# EAGLE design ESCON Module 48 (EAGLE 9.6.2)

## Sheet 1 of 3
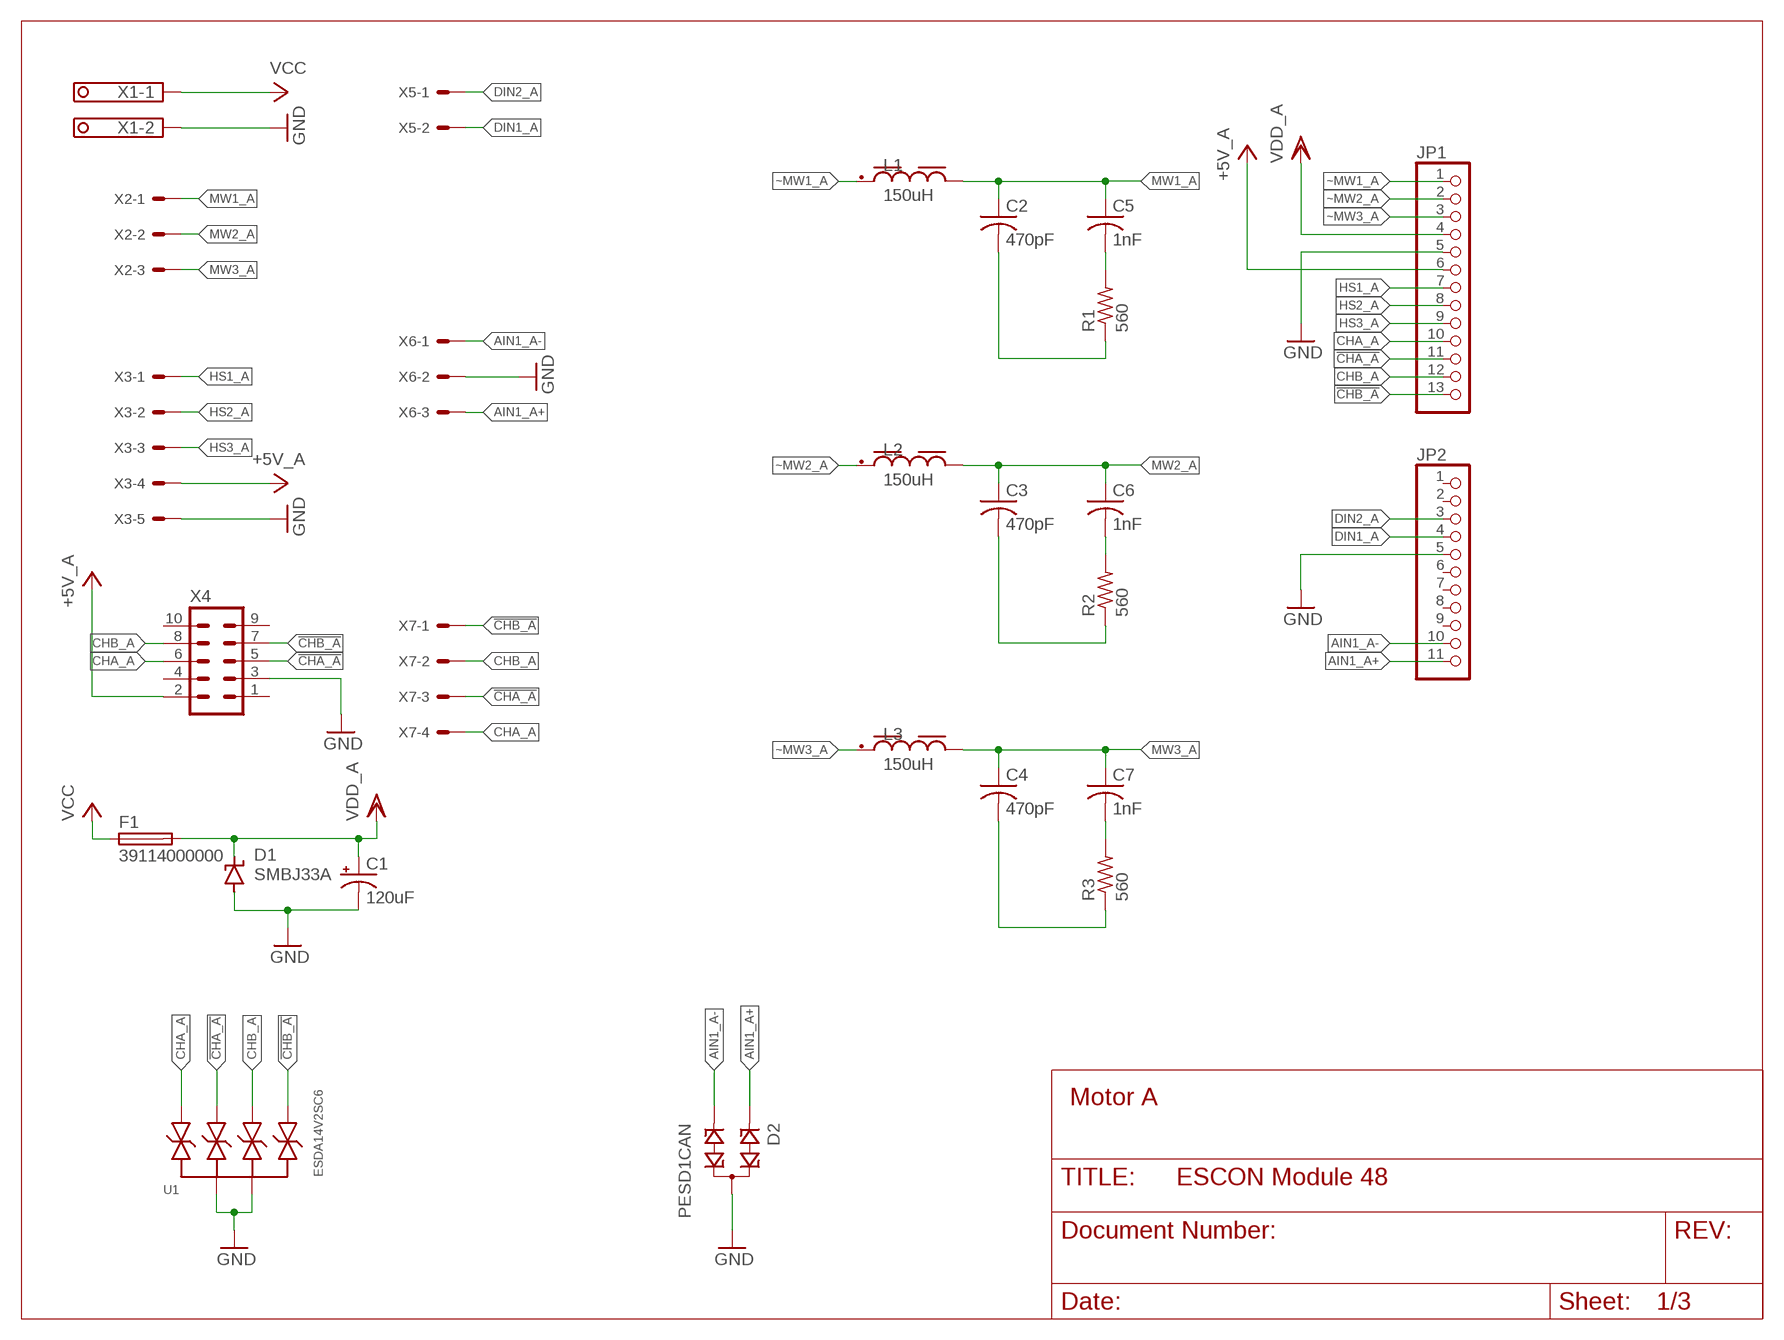
[diagram p0: schematic, sheet 1]

### Parts
C1  120uF  CPOL-USE7.5-16  [E7,5-16]
C2  470pF  C-USC0603  [C0603]
C3  470pF  C-USC0603  [C0603]
C4  470pF  C-USC0603  [C0603]
C5  1nF  C-USC0603  [C0603]
C6  1nF  C-USC0603  [C0603]
C7  1nF  C-USC0603  [C0603]
D1  SMBJ33A  SUPPRESSOR-SMBJ  [SMBJ]
D2  PESD1CAN  [SOT23]
F1  39114000000  TE5  [TE5]
JP1  PINHD-1X13  [1X13]
JP2  PINHD-1X11  [1X11]
L1  150uH  WE-PD_1210_7447709151  [WE-PD_1210]
L2  150uH  WE-PD_1210_7447709151  [WE-PD_1210]
L3  150uH  WE-PD_1210_7447709151  [WE-PD_1210]
R1  560  R-US_R0603  [R0603]
R2  560  R-US_R0603  [R0603]
R3  560  R-US_R0603  [R0603]
U1  ESDA14V2SC6  [SOT95P280X145-6N]
X1  TERMINAL-BLOCK-3.5MM-2-PIN-LONG-PAD  [TERMINAL-BLOCK-2-PIN-3.5MM-LONG-PAD]
X2  JST-XH-03-PIN-LONG-PAD  [JST-XH-03-PACKAGE-LONG-PAD]
X3  JST-XH-05-PIN-LONG-PAD  [JST-XH-05-PACKAGE-LONG-PAD]
X4  ML10LP-V  [10LP-V]
X5  JST-XH-02-PIN-LONG-PAD  [JST-XH-02-PACKAGE-LONG-PAD]
X6  JST-XH-03-PIN-LONG-PAD  [JST-XH-03-PACKAGE-LONG-PAD]
X7  JST-XH-04-PIN-LONG-PAD  [JST-XH-04-PACKAGE-LONG-PAD]

### Nets
!CHA_A [signal]: JP1.11 U1.3 X4.5 X7.3
!CHB_A [signal]: JP1.13 U1.6 X4.7 X7.1
+5V_A [power]: JP1.6 X3.4 X4.2
AIN1_A+ [signal]: D2.1 JP2.11 X6.3
AIN1_A- [signal]: D2.2 JP2.10 X6.1
CHA_A [signal]: JP1.10 U1.1 X4.6 X7.4
CHB_A [signal]: JP1.12 U1.4 X4.8 X7.2
DIN1_A [signal]: JP2.4 X5.2
DIN2_A [signal]: JP2.3 X5.1
GND [signal]: C1.- D1.A D2.3 JP1.5 JP2.5 U1.2 U1.5 X1.2 X3.5 X4.3 X6.2 ; also sheet 2,3
HS1_A [motor]: JP1.7 X3.1
HS2_A [motor]: JP1.8 X3.2
HS3_A [motor]: JP1.9 X3.3
MW1_A [motor]: C2.1 C5.1 L1.2 X2.1
MW2_A [motor]: C3.1 C6.1 L2.2 X2.2
MW3_A [motor]: C4.1 C7.1 L3.2 X2.3
N$1: C5.2 R1.2
N$2: C6.2 R2.2
N$3: C7.2 R3.2
N$15: C4.2 R3.1
N$16: C3.2 R2.1
N$17: C2.2 R1.1
VCC [power]: F1.1 X1.1 ; also sheet 2,3
VDD_A [power]: C1.+ D1.C F1.2 JP1.4
~MW1_A [motor]: JP1.1 L1.1
~MW2_A [motor]: JP1.2 L2.1
~MW3_A [motor]: JP1.3 L3.1
Unconnected: JP2.1 JP2.2 JP2.6 JP2.7 JP2.8 JP2.9 X4.1 X4.4 X4.9 X4.10

### Notes on the sheet
- Motor A

## Sheet 2 of 3
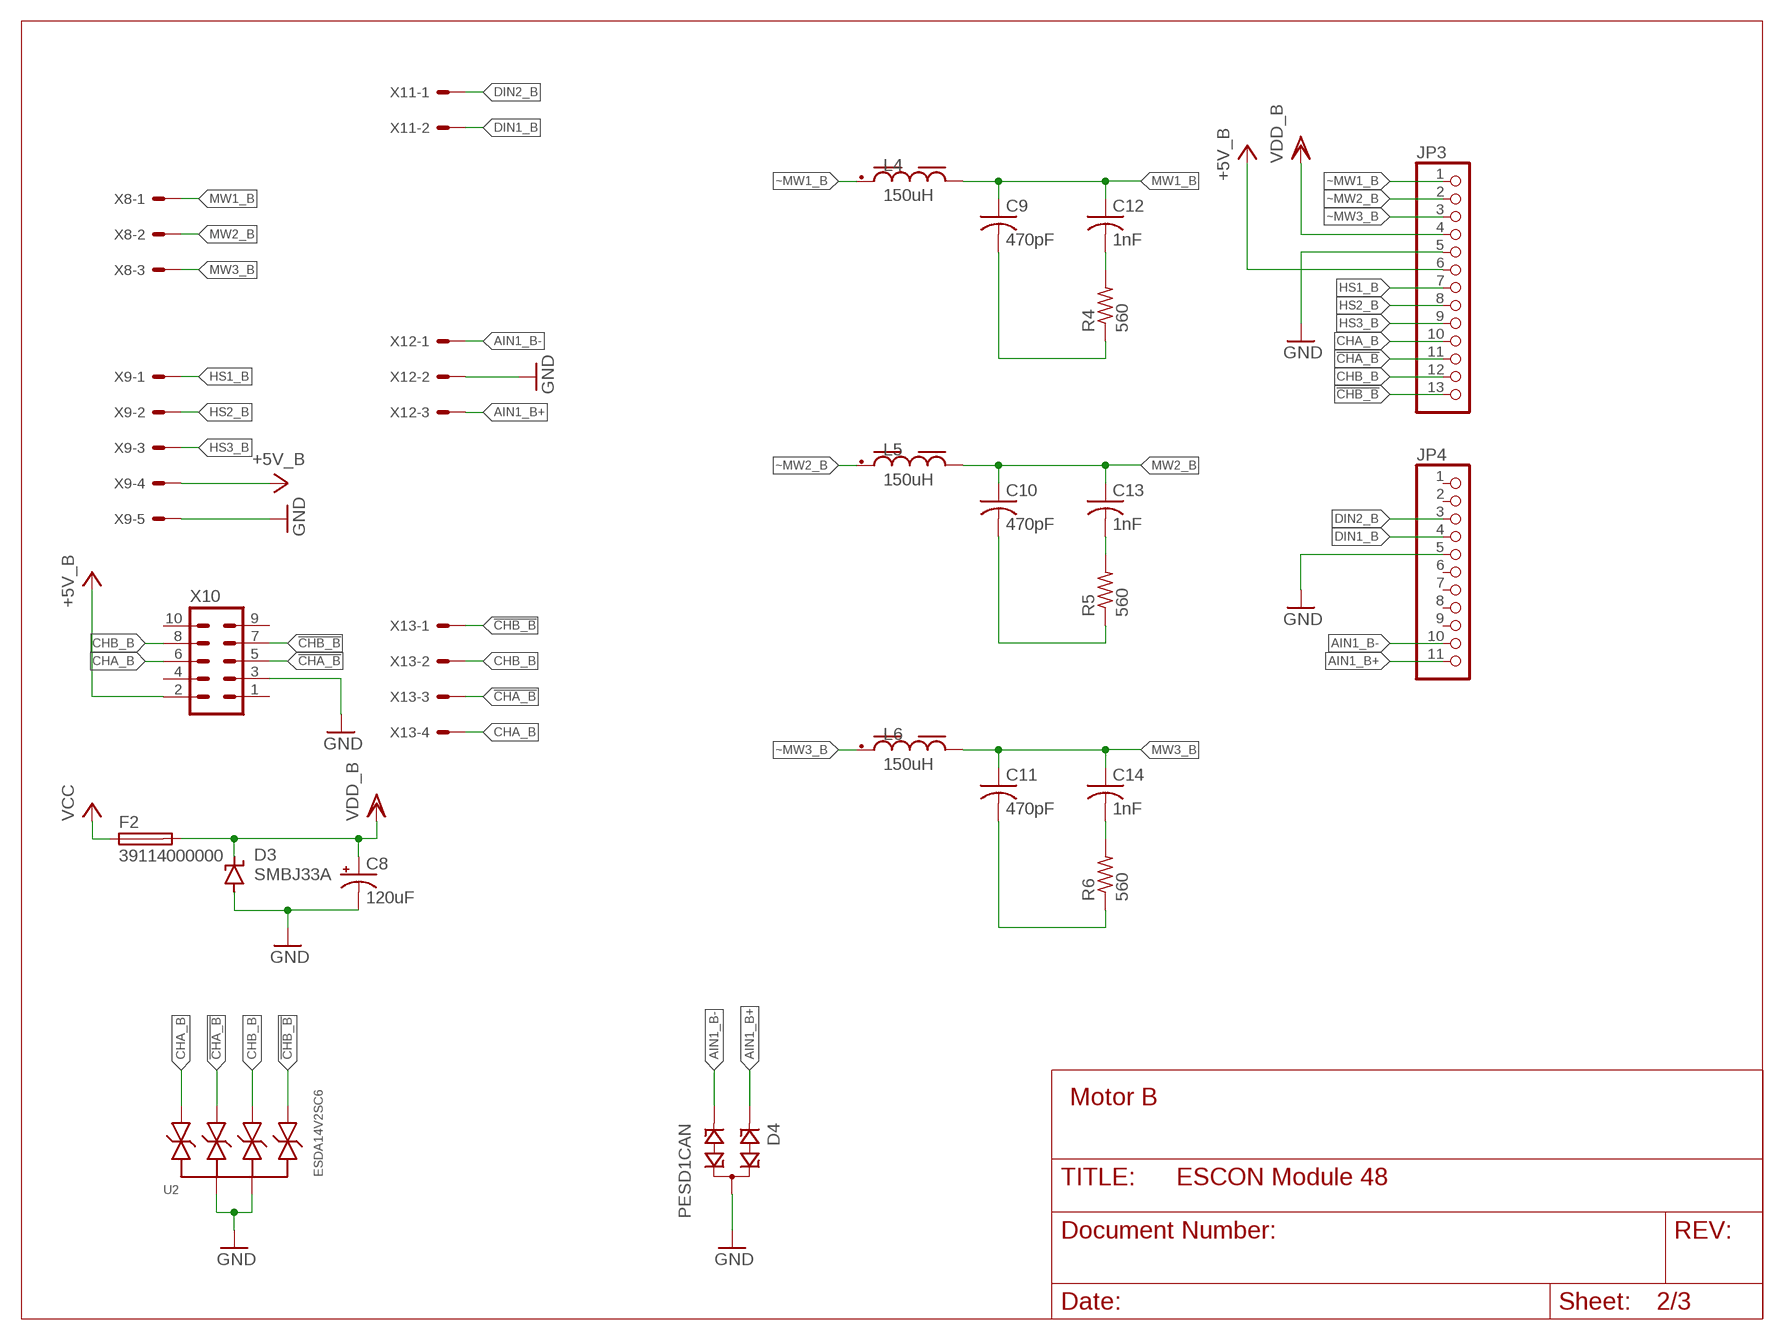
[diagram p1: schematic, sheet 2]

### Parts
C8  120uF  CPOL-USE7.5-16  [E7,5-16]
C9  470pF  C-USC0603  [C0603]
C10  470pF  C-USC0603  [C0603]
C11  470pF  C-USC0603  [C0603]
C12  1nF  C-USC0603  [C0603]
C13  1nF  C-USC0603  [C0603]
C14  1nF  C-USC0603  [C0603]
D3  SMBJ33A  SUPPRESSOR-SMBJ  [SMBJ]
D4  PESD1CAN  [SOT23]
F2  39114000000  TE5  [TE5]
JP3  PINHD-1X13  [1X13]
JP4  PINHD-1X11  [1X11]
L4  150uH  WE-PD_1210_7447709151  [WE-PD_1210]
L5  150uH  WE-PD_1210_7447709151  [WE-PD_1210]
L6  150uH  WE-PD_1210_7447709151  [WE-PD_1210]
R4  560  R-US_R0603  [R0603]
R5  560  R-US_R0603  [R0603]
R6  560  R-US_R0603  [R0603]
U2  ESDA14V2SC6  [SOT95P280X145-6N]
X8  JST-XH-03-PIN-LONG-PAD  [JST-XH-03-PACKAGE-LONG-PAD]
X9  JST-XH-05-PIN-LONG-PAD  [JST-XH-05-PACKAGE-LONG-PAD]
X10  ML10LP-V  [10LP-V]
X11  JST-XH-02-PIN-LONG-PAD  [JST-XH-02-PACKAGE-LONG-PAD]
X12  JST-XH-03-PIN-LONG-PAD  [JST-XH-03-PACKAGE-LONG-PAD]
X13  JST-XH-04-PIN-LONG-PAD  [JST-XH-04-PACKAGE-LONG-PAD]

### Nets
!CHA_B [signal]: JP3.11 U2.3 X10.5 X13.3
!CHB_B [signal]: JP3.13 U2.6 X10.7 X13.1
+5V_B [power]: JP3.6 X9.4 X10.2
AIN1_B+ [signal]: D4.1 JP4.11 X12.3
AIN1_B- [signal]: D4.2 JP4.10 X12.1
CHA_B [signal]: JP3.10 U2.1 X10.6 X13.4
CHB_B [signal]: JP3.12 U2.4 X10.8 X13.2
DIN1_B [signal]: JP4.4 X11.2
DIN2_B [signal]: JP4.3 X11.1
GND [signal]: C8.- D3.A D4.3 JP3.5 JP4.5 U2.2 U2.5 X9.5 X10.3 X12.2 ; also sheet 1,3
HS1_B [motor]: JP3.7 X9.1
HS2_B [motor]: JP3.8 X9.2
HS3_B [motor]: JP3.9 X9.3
MW1_B [motor]: C9.1 C12.1 L4.2 X8.1
MW2_B [motor]: C10.1 C13.1 L5.2 X8.2
MW3_B [motor]: C11.1 C14.1 L6.2 X8.3
N$4: C12.2 R4.2
N$5: C13.2 R5.2
N$6: C14.2 R6.2
N$7: C11.2 R6.1
N$8: C10.2 R5.1
N$9: C9.2 R4.1
VCC [power]: F2.1 ; also sheet 1,3
VDD_B [power]: C8.+ D3.C F2.2 JP3.4
~MW1_B [motor]: JP3.1 L4.1
~MW2_B [motor]: JP3.2 L5.1
~MW3_B [motor]: JP3.3 L6.1
Unconnected: JP4.1 JP4.2 JP4.6 JP4.7 JP4.8 JP4.9 X10.1 X10.4 X10.9 X10.10

### Notes on the sheet
- Motor B

## Sheet 3 of 3
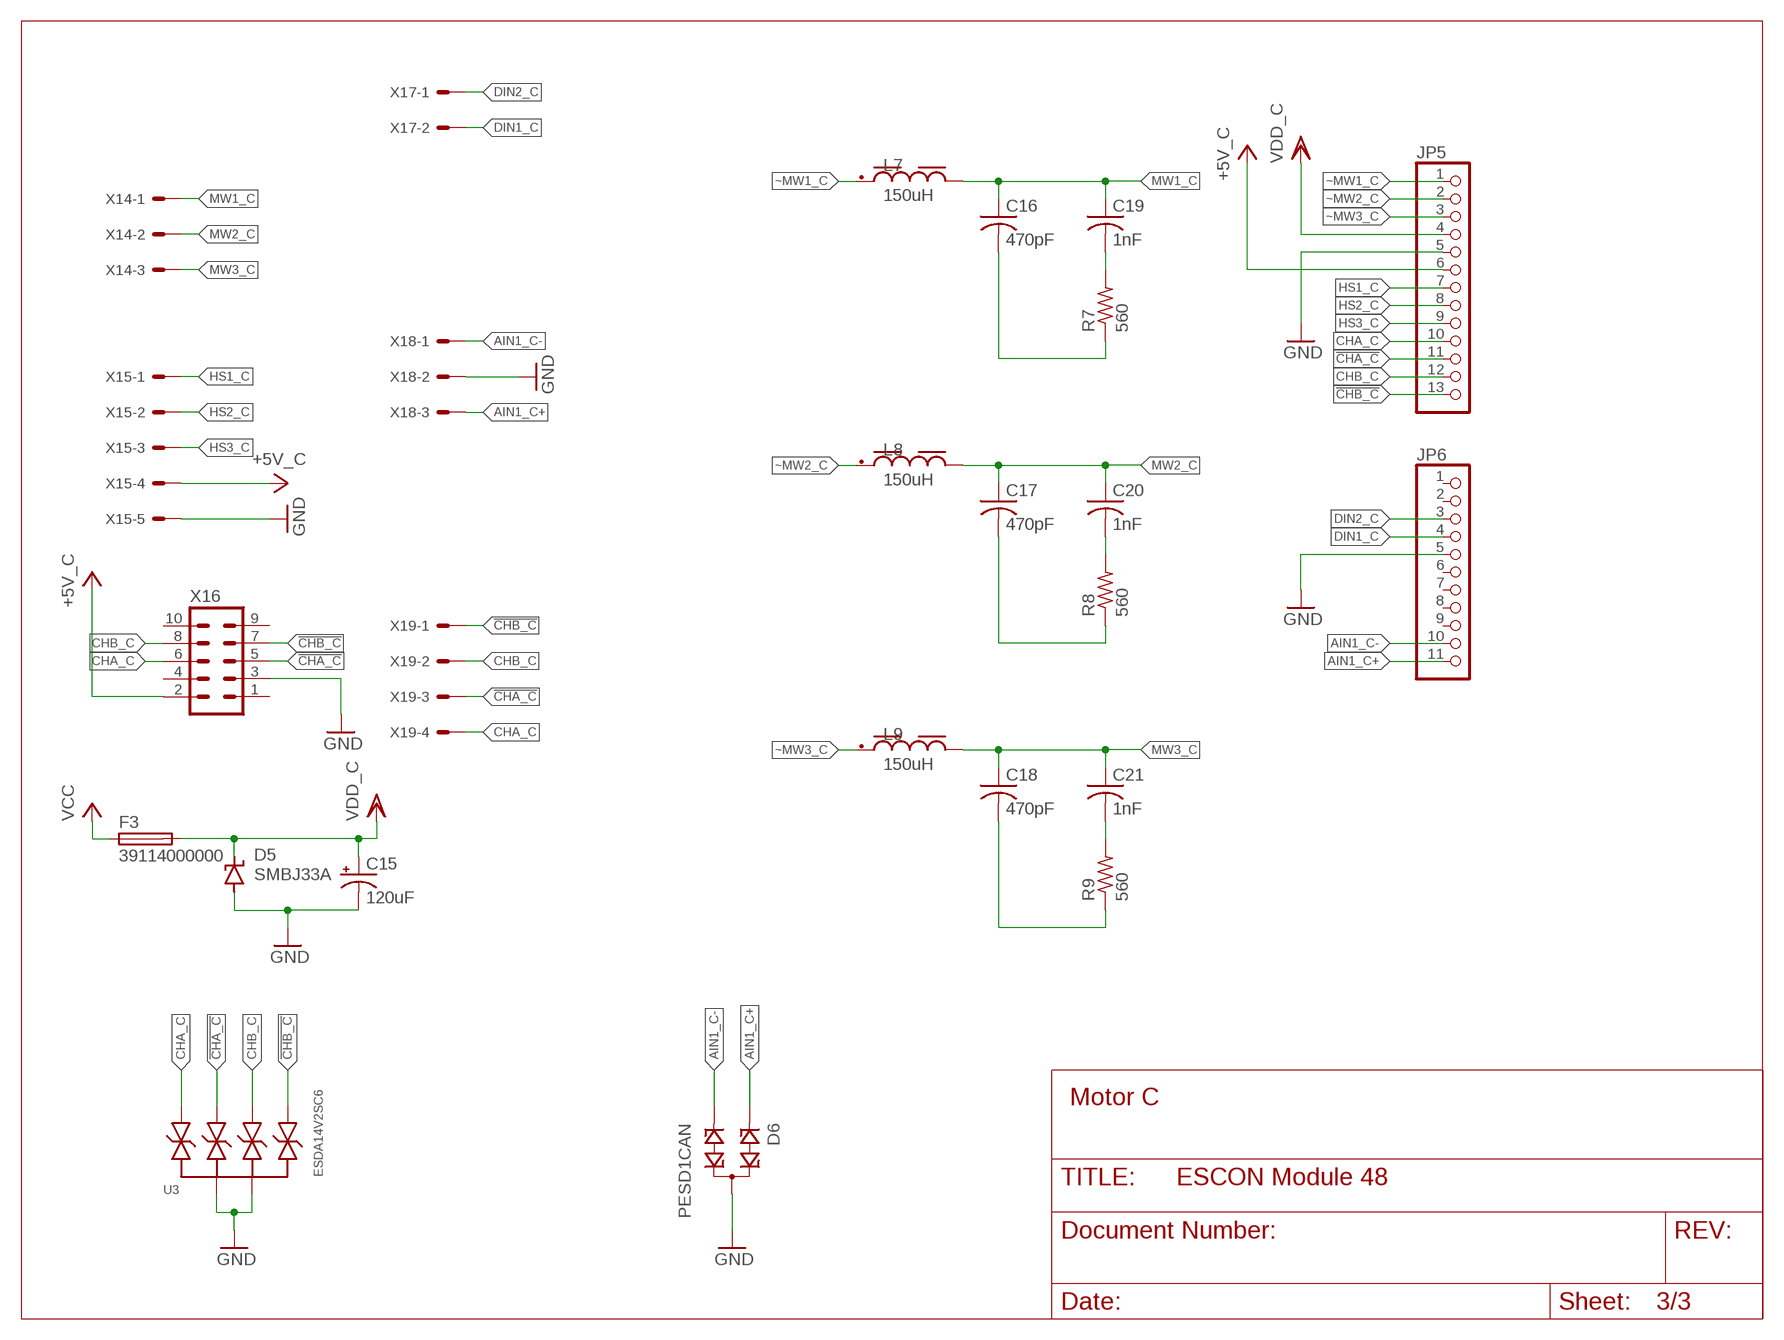
[diagram p2: schematic, sheet 3]

### Parts
C15  120uF  CPOL-USE7.5-16  [E7,5-16]
C16  470pF  C-USC0603  [C0603]
C17  470pF  C-USC0603  [C0603]
C18  470pF  C-USC0603  [C0603]
C19  1nF  C-USC0603  [C0603]
C20  1nF  C-USC0603  [C0603]
C21  1nF  C-USC0603  [C0603]
D5  SMBJ33A  SUPPRESSOR-SMBJ  [SMBJ]
D6  PESD1CAN  [SOT23]
F3  39114000000  TE5  [TE5]
JP5  PINHD-1X13  [1X13]
JP6  PINHD-1X11  [1X11]
L7  150uH  WE-PD_1210_7447709151  [WE-PD_1210]
L8  150uH  WE-PD_1210_7447709151  [WE-PD_1210]
L9  150uH  WE-PD_1210_7447709151  [WE-PD_1210]
R7  560  R-US_R0603  [R0603]
R8  560  R-US_R0603  [R0603]
R9  560  R-US_R0603  [R0603]
U3  ESDA14V2SC6  [SOT95P280X145-6N]
X14  JST-XH-03-PIN-LONG-PAD  [JST-XH-03-PACKAGE-LONG-PAD]
X15  JST-XH-05-PIN-LONG-PAD  [JST-XH-05-PACKAGE-LONG-PAD]
X16  ML10LP-V  [10LP-V]
X17  JST-XH-02-PIN-LONG-PAD  [JST-XH-02-PACKAGE-LONG-PAD]
X18  JST-XH-03-PIN-LONG-PAD  [JST-XH-03-PACKAGE-LONG-PAD]
X19  JST-XH-04-PIN-LONG-PAD  [JST-XH-04-PACKAGE-LONG-PAD]

### Nets
!CHA_C [signal]: JP5.11 U3.3 X16.5 X19.3
!CHB_C [signal]: JP5.13 U3.6 X16.7 X19.1
+5V_C [power]: JP5.6 X15.4 X16.2
AIN1_C+ [signal]: D6.1 JP6.11 X18.3
AIN1_C- [signal]: D6.2 JP6.10 X18.1
CHA_C [signal]: JP5.10 U3.1 X16.6 X19.4
CHB_C [signal]: JP5.12 U3.4 X16.8 X19.2
DIN1_C [signal]: JP6.4 X17.2
DIN2_C [signal]: JP6.3 X17.1
GND [signal]: C15.- D5.A D6.3 JP5.5 JP6.5 U3.2 U3.5 X15.5 X16.3 X18.2 ; also sheet 1,2
HS1_C [motor]: JP5.7 X15.1
HS2_C [motor]: JP5.8 X15.2
HS3_C [motor]: JP5.9 X15.3
MW1_C [motor]: C16.1 C19.1 L7.2 X14.1
MW2_C [motor]: C17.1 C20.1 L8.2 X14.2
MW3_C [motor]: C18.1 C21.1 L9.2 X14.3
N$10: C19.2 R7.2
N$11: C20.2 R8.2
N$12: C21.2 R9.2
N$13: C18.2 R9.1
N$14: C17.2 R8.1
N$18: C16.2 R7.1
VCC [power]: F3.1 ; also sheet 1,2
VDD_C [power]: C15.+ D5.C F3.2 JP5.4
~MW1_C [motor]: JP5.1 L7.1
~MW2_C [motor]: JP5.2 L8.1
~MW3_C [motor]: JP5.3 L9.1
Unconnected: JP6.1 JP6.2 JP6.6 JP6.7 JP6.8 JP6.9 X16.1 X16.4 X16.9 X16.10

### Notes on the sheet
- Motor C

## Library data of the parts
C1 C8 C15 = rcl:CPOL-US: POLARIZED CAPACITOR, American symbol; SPICEPREFIX: C
C2-C7 C9-C14 C16-C21 = rcl:C-US: CAPACITOR, American symbol; SPICEPREFIX: C
D1 D3 D5 = diode:SUPPRESSOR-: Suppressor diode
D2 D4 D6 = diode:PESD1CAN: CAN bus ESD protection diode Source: http://www.nxp.com/documents/data_sheet/PESD1CAN.pdf
F1-F3 = fuse:TE5: FUSE Wickmann; OC_FARNELL: unknown; OC_NEWARK: unknown
JP1 JP3 JP5 = pinhead:PINHD-1X13: PIN HEADER
JP2 JP4 JP6 = pinhead:PINHD-1X11: PIN HEADER
L1-L9 = Eagle_WE-PD (rev20a):WE-PD_1210: WE-PD SMT Power Inductor Characteristics AECQ 200 Qualified Ultra low RDC and RAC Highest possible saturation current based on Ferrite Suitable for switching frequency up to 10MHz Temperature dependent parameter available on Redexpert Operating Temperature from -40°C to +125°C / +150°C Types WE-PD: Since always with low loss material, tight tolerances and high saturation behavior compared to other manufacturers in the market WE-PD Robust: Plastic base improves the mechanical stability and efficiency WE-PD Performance: MnZn core improves Saturation and RDC for highest efficiency Applications Switch Mode Power supplies from 0,1W up to 300W Integrated DC DC Converter Ideal for Switch Mode Power supplies with extreme high efficiency (>95%) <https://www.we-online.com/catalog/media/o14825v209%20Family_WE-PD.jpg> Details see: https://www.we-online.com/catalog/en/WE-PD/ Details see: https://katalog.we-online.com/en/pbs/WE-PD Updated by Yingchun,Shan 2019-07-25 2019 (C) Wurth Elektronik; DATASHEET-URL: https://www.we-online.com/catalog/datasheet/7447709151.pdf; FRES: 3.5MHz; IR: 2.1A; ISAT: 2.7A; MOUNT: SMT; PART-NUMBER: 7447709151; RDC-MAX: 200mOhm; RDC-TYP: 151mOhm; VERSION: Standard
R1-R9 = rcl:R-US_: RESISTOR, American symbol; SPICEPREFIX: R
U1-U3 = ESDA14V2SC6:ESDA14V2SC6: None Check availability <https://pricing.snapeda.com/parts/ESDA14V2SC6/STMicroelectronics/view-part?ref=eda>; AVAILABILITY: In Stock; DESCRIPTION: - Clamp - Ipp Tvs Diode Surface Mount SOT-23-6; MF: STMicroelectronics; MP: ESDA14V2SC6; PACKAGE: SOT-23-6 STMicroelectronics; PRICE: None; PURCHASE-URL: https://pricing.snapeda.com/search/part/ESDA14V2SC6/?ref=eda
X1 = Rembrandt Electronics - Terminal Block 3-5mm v1-0:TERMINAL-BLOCK-3.5MM-2-PIN: Terminal Block 3.5mm Pitch: 3,5 mm Number of pins: 2 Created by Rembrandt Electronics www.rembrandtelectronics.com
X2 X6 X8 X12 X14 X18 = Rembrandt Electronics - JST XH Connectors v1-0:JST-XH-03-PIN: JST XH Connector 2 Pin Wire to board connector. Pitch: 2,54 mm, (0.100") Number of pins: 3 Created by Rembrandt Electronics www.rembrandtelectronics.com
X3 X9 X15 = Rembrandt Electronics - JST XH Connectors v1-0:JST-XH-05-PIN: JST XH Connector 2 Pin Wire to board connector. Pitch: 2,54 mm, (0.100") Number of pins: 5 Created by Rembrandt Electronics www.rembrandtelectronics.com
X4 X10 X16 = con IEC60603-13:ML10: IEC 60603-13 IDC male header, pitch 100mil
X5 X11 X17 = Rembrandt Electronics - JST XH Connectors v1-0:JST-XH-02-PIN: JST XH Connector 2 Pin Wire to board connector. Pitch: 2,54 mm, (0.100") Number of pins: 2 Created by Rembrandt Electronics www.rembrandtelectronics.com
X7 X13 X19 = Rembrandt Electronics - JST XH Connectors v1-0:JST-XH-04-PIN: JST XH Connector 2 Pin Wire to board connector. Pitch: 2,54 mm, (0.100") Number of pins: 4 Created by Rembrandt Electronics www.rembrandtelectronics.com

## Net classes
0 default: width 0.305 mm, drill 0.203 mm, clearance 0.152 mm
1 motor: width 1.524 mm, drill 0.203 mm, clearance 0.152 mm
2 power: width 1.524 mm, drill 0.203 mm, clearance 0.152 mm
3 signal: width 0.305 mm, drill 0.203 mm, clearance 0.152 mm

## Board
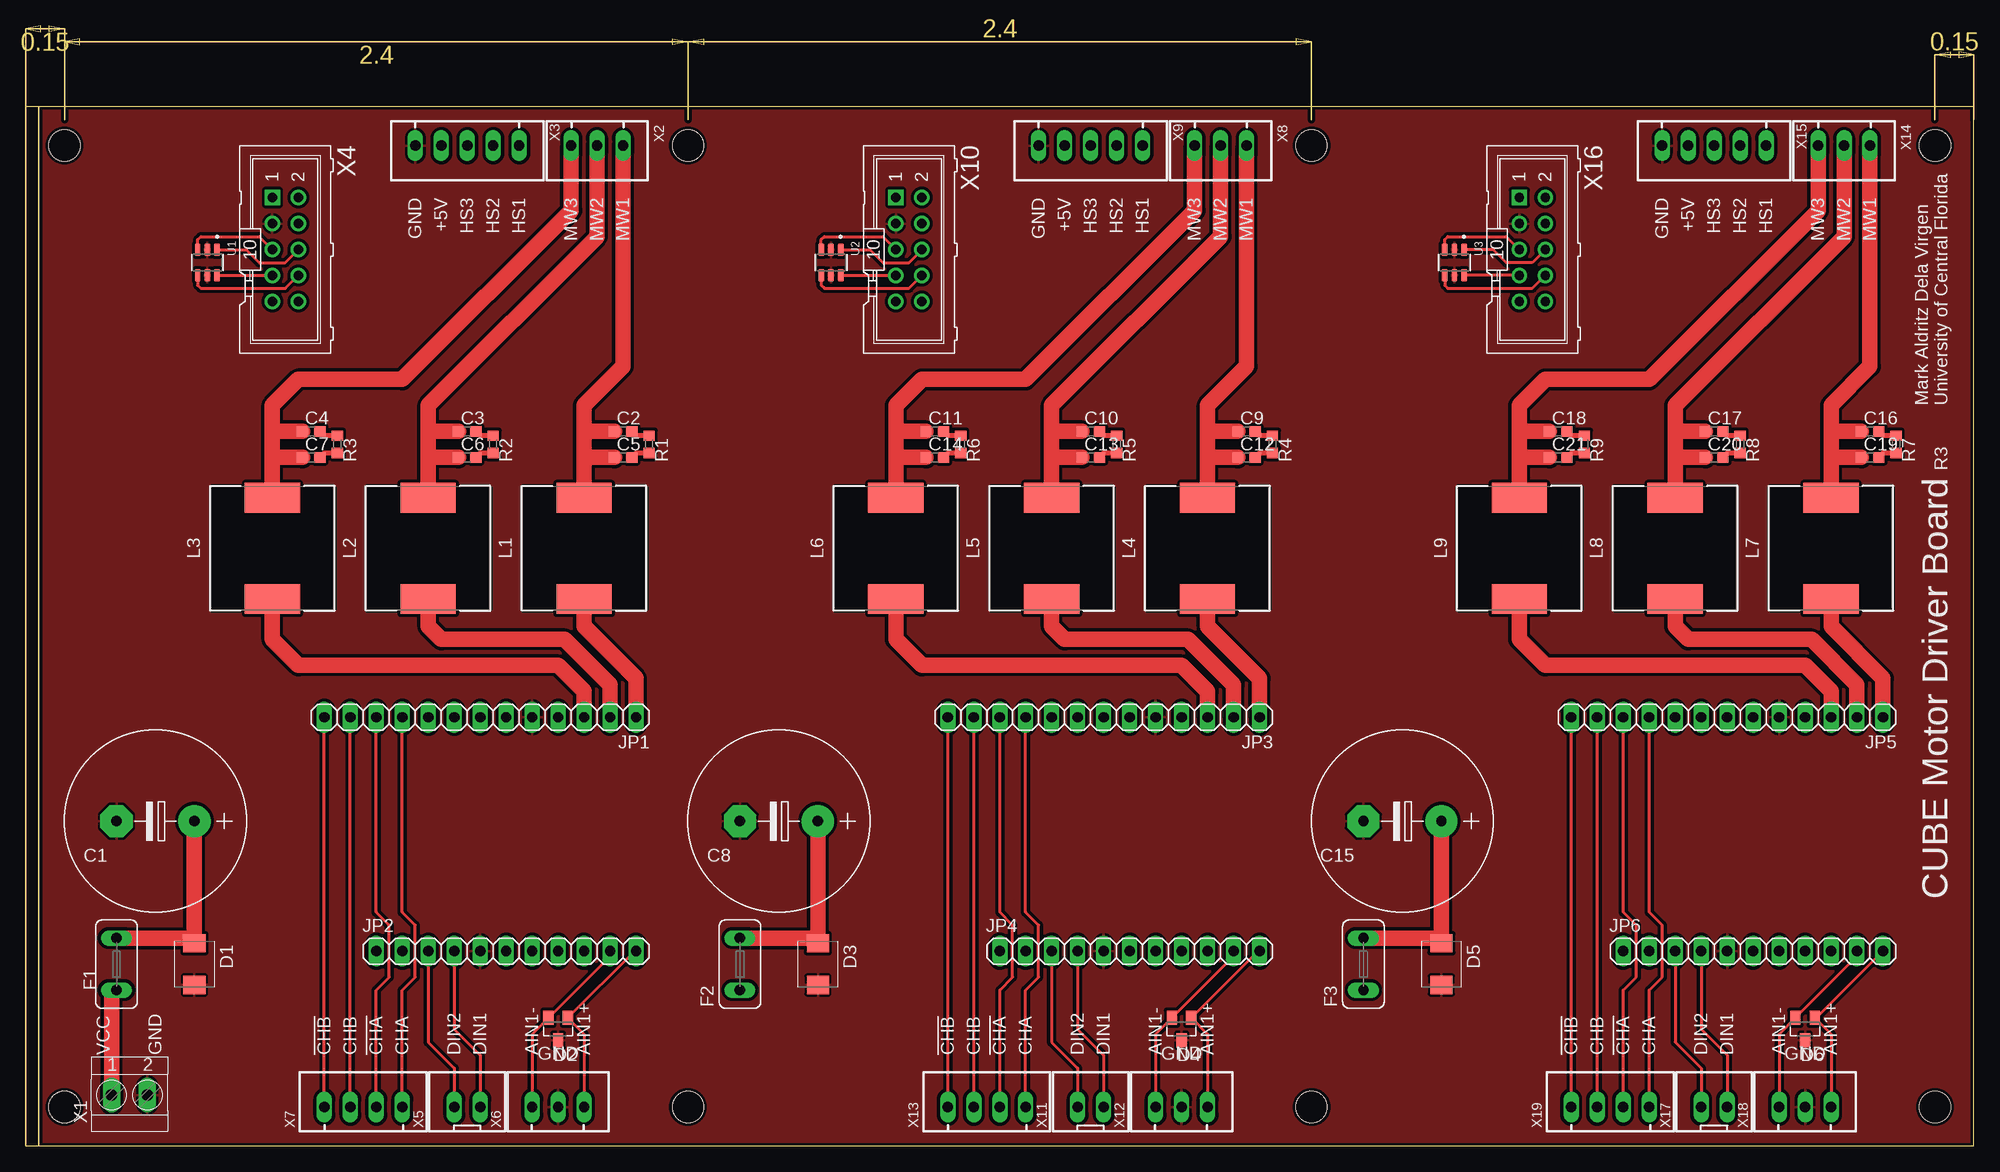
[diagram p3: board, top side]
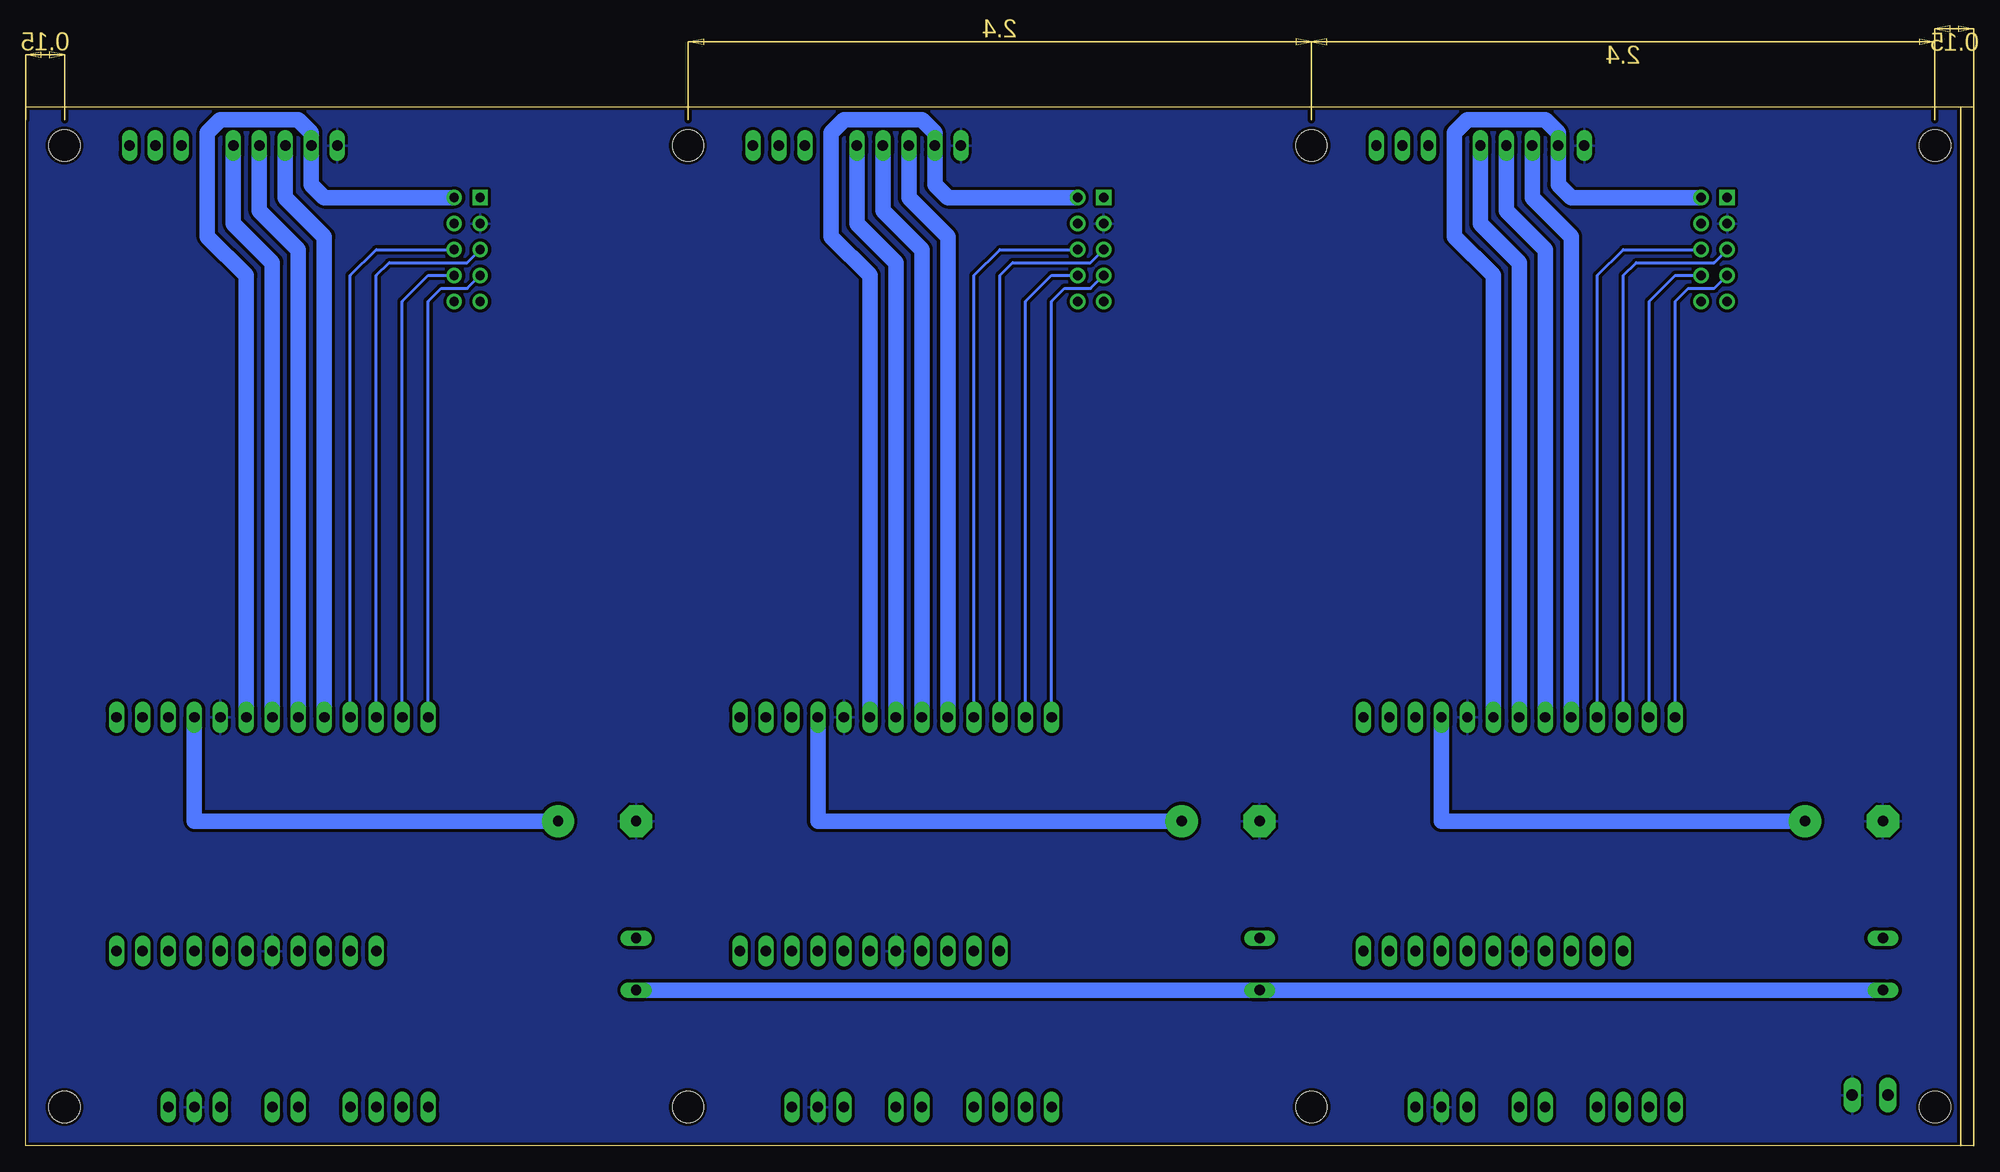
[diagram p4: board, bottom side, seen from below]

Size 190.5 x 101.6 mm. Coordinates in mm from the lower left corner, seen from the top.
Outline: 0,0 190.5,0 190.5,101.6 0,101.6 0,0
Copper layers (1*16): Top 0.035mm / dielectric 1.5mm / Bottom 0.035mm
Design rules "SparkFun-2-Layer-General-JLCPCB": minimum track width 7mil, minimum drill 0.3mm, track to track 7mil, track to pad 7mil, pad to pad 7mil, via to via 7mil, smd to smd 7mil, copper to edge 7mil, drill to drill 7mil, minimum pad ring 7mil, minimum via ring 7mil, stop-mask expansion 3mil, vias tented up to drill 25mil, thermal gap 10mil
Holes 3.05 mm at 64.77,97.79 125.73,97.79 186.69,97.79 3.81,97.79 64.77,3.81 125.73,3.81 186.69,3.81 3.81,3.81

### Footprints (pad centres in the part's own frame; a part is rotated, then mirrored left to right if it is on the bottom)
E7,5-18 = drill 1.016 pad 3.15: + -3.81,0 | drill 1.016 pad 3.15 octagon: - 3.81,0
C0603 = smd 1.1 x 1: 1 -0.85,0; 2 0.85,0
SMBJ = smd 1.78 x 2.16: A 2.04,0; C -2.03,0
SOT23 = smd 1 x 1.4: 1 -0.95,-1.1; 2 0.95,-1.1; 3 0,1.1
TE5 = drill 1.016 long: 1 -2.54,0; 2 2.54,0
1X13 = drill 1.016 long: 1 -15.24,0; 2 -12.7,0; 3 -10.16,0; 4 -7.62,0; 5 -5.08,0; 6 -2.54,0; 7 0,0; 8 2.54,0; 9 5.08,0; 10 7.62,0; 11 10.16,0; 12 12.7,0; 13 15.24,0
1X11 = drill 1.016 long: 1 -12.7,0; 2 -10.16,0; 3 -7.62,0; 4 -5.08,0; 5 -2.54,0; 6 0,0; 7 2.54,0; 8 5.08,0; 9 7.62,0; 10 10.16,0; 11 12.7,0
WE-PD_1210 = smd 2.9 x 5.4: 1 -4.95,0; 2 4.95,0
R0603 = smd 1 x 1.1: 1 -0.85,0; 2 0.85,0
SOT95P280X145-6N = smd 1.21 x 0.58: 1 -1.255,0.95; 2 -1.255,0; 3 -1.255,-0.95; 4 1.255,-0.95; 5 1.255,0; 6 1.255,0.95
TERMINAL-BLOCK-2-PIN-3.5MM-LONG-PAD = drill 1.1 pad 1.7 long: 1 -1.75,-0.1; 2 1.75,-0.1
JST-XH-03-PACKAGE-LONG-PAD = drill 1.016 long: 1 -2.54,0; 2 0,0; 3 2.54,0
JST-XH-05-PACKAGE-LONG-PAD = drill 1.016 long: 1 -5.08,0; 2 -2.54,0; 3 0,0; 4 2.54,0; 5 5.08,0
10LP-V = drill 0.9 pad 1.5 square: 1 -5.08,-1.27 | drill 0.9 pad 1.5: 2 -5.08,1.27; 3 -2.54,-1.27; 4 -2.54,1.27; 5 0,-1.27; 6 0,1.27; 7 2.54,-1.27; 8 2.54,1.27; 9 5.08,-1.27; 10 5.08,1.27
JST-XH-02-PACKAGE-LONG-PAD = drill 1.016 long: 1 -1.27,0; 2 1.27,0
JST-XH-04-PACKAGE-LONG-PAD = drill 1.016 long: 1 -3.81,0; 2 -1.27,0; 3 1.27,0; 4 3.81,0

### Placement (x,y rotation side)
C1  3300uF  [E7,5-18]  12.7,31.75 180 top
C2  58.42,69.85 0 top
C3  43.18,69.85 0 top
C4  27.94,69.85 0 top
C5  58.42,67.31 0 top
C6  43.18,67.31 0 top
C7  27.94,67.31 0 top
C8  3300uF  [E7,5-18]  73.66,31.75 180 top
C9  119.38,69.85 0 top
C10  104.14,69.85 0 top
C11  88.9,69.85 0 top
C12  119.38,67.31 0 top
C13  104.14,67.31 0 top
C14  88.9,67.31 0 top
C15  3300uF  [E7,5-18]  134.62,31.75 180 top
C16  180.34,69.85 0 top
C17  165.1,69.85 0 top
C18  149.86,69.85 0 top
C19  180.34,67.31 0 top
C20  165.1,67.31 0 top
C21  149.86,67.31 0 top
D1  16.51,17.78 270 top
D2  52.07,11.43 180 top
D3  77.47,17.78 270 top
D4  113.03,11.43 180 top
D5  138.43,17.78 270 top
D6  173.99,11.43 180 top
F1  8.89,17.78 90 top
F2  69.85,17.78 90 top
F3  130.81,17.78 90 top
JP1  44.45,41.91 180 top
JP2  46.99,19.05 0 top
JP3  105.41,41.91 180 top
JP4  107.95,19.05 0 top
JP5  166.37,41.91 180 top
JP6  168.91,19.05 0 top
L1  54.61,58.42 90 top
L2  39.37,58.42 90 top
L3  24.13,58.42 90 top
L4  115.57,58.42 90 top
L5  100.33,58.42 90 top
L6  85.09,58.42 90 top
L7  176.53,58.42 90 top
L8  161.29,58.42 90 top
L9  146.05,58.42 90 top
R1  60.96,68.58 270 top
R2  45.72,68.58 270 top
R3  30.48,68.58 270 top
R4  121.92,68.58 270 top
R5  106.68,68.58 270 top
R6  91.44,68.58 270 top
R7  182.88,68.58 270 top
R8  167.64,68.58 270 top
R9  152.4,68.58 270 top
U1  17.78,86.36 270 top
U2  78.74,86.36 270 top
U3  139.7,86.36 270 top
X1  10.16,5.08 0 top
X2  55.88,97.79 180 top
X3  43.18,97.79 180 top
X4  25.4,87.63 270 top
X5  43.18,3.81 0 top
X6  52.07,3.81 0 top
X7  33.02,3.81 0 top
X8  116.84,97.79 180 top
X9  104.14,97.79 180 top
X10  86.36,87.63 270 top
X11  104.14,3.81 0 top
X12  113.03,3.81 0 top
X13  93.98,3.81 0 top
X14  177.8,97.79 180 top
X15  165.1,97.79 180 top
X16  147.32,87.63 270 top
X17  165.1,3.81 0 top
X18  173.99,3.81 0 top
X19  154.94,3.81 0 top

### Tracks (layer width: path | path; a pad name or v marks a point on that pad's centre or on a via)
!CHA_A
  Top 0.305: X7.3 34.29,15.24 35.56,16.51 35.56,21.59 34.29,22.86 JP1.11 | X4.5 22.86,88.9 17.14,88.9 16.83,88.58 U1.3
  Bottom 0.305: JP1.11 34.29,85.09 33.02,86.36 25.4,86.36 X4.5
!CHA_B
  Top 0.305: X13.3 95.25,15.24 96.52,16.51 96.52,21.59 95.25,22.86 JP3.11 | X10.5 83.82,88.9 78.11,88.9 77.79,88.58 U2.3
  Bottom 0.305: JP3.11 95.25,85.09 93.98,86.36 86.36,86.36 X10.5
!CHA_C
  Top 0.305: X19.3 156.21,15.24 157.48,16.51 157.48,21.59 156.21,22.86 JP5.11 | X16.5 144.78,88.9 139.06,88.9 138.75,88.58 U3.3
  Bottom 0.305: JP5.11 156.21,85.09 154.94,86.36 147.32,86.36 X16.5
!CHB_A
  Top 0.305: X7.1 JP1.13 | U1.6 18.75,85.09 X4.7
  Bottom 0.305: JP1.13 29.21,82.55 27.94,83.82 25.4,83.82 X4.7
!CHB_B
  Top 0.305: X13.1 JP3.13 | U2.6 79.7,85.09 X10.7
  Bottom 0.305: JP3.13 90.17,82.55 88.9,83.82 86.36,83.82 X10.7
!CHB_C
  Top 0.305: X19.1 JP5.13 | X16.7 140.66,85.09 U3.6
  Bottom 0.305: JP5.13 151.13,82.55 149.86,83.82 147.32,83.82 X16.7
+5V_A
  Bottom 1.524: JP1.6 46.99,85.09 50.8,88.9 50.8,99.06 49.53,100.33 41.91,100.33 40.64,99.06 X3.4 40.64,93.98 39.37,92.71 X4.2
+5V_B
  Bottom 1.524: JP3.6 107.95,85.09 111.76,88.9 111.76,99.06 110.49,100.33 102.87,100.33 101.6,99.06 X9.4 101.6,93.98 100.33,92.71 X10.2
+5V_C
  Bottom 1.524: JP5.6 168.91,85.09 172.72,88.9 172.72,99.06 171.45,100.33 163.83,100.33 162.56,99.06 X15.4 162.56,93.98 161.29,92.71 X16.2
AIN1_A+
  Top 0.305: X6.3 54.61,10.94 D2.1 59.54,19.05 JP2.11
AIN1_A-
  Top 0.305: X6.1 49.53,10.94 D2.2 57.15,18.56 JP2.10
AIN1_B+
  Top 0.305: X12.3 115.57,10.94 D4.1 120.5,19.05 JP4.11
AIN1_B-
  Top 0.305: X12.1 110.49,10.94 D4.2 118.11,18.56 JP4.10
AIN1_C+
  Top 0.305: X18.3 176.53,10.94 D6.1 175.09,12.53 JP6.11
AIN1_C-
  Top 0.305: X18.1 171.45,10.94 D6.2 179.07,18.56 JP6.10
CHA_A
  Top 0.305: X7.4 36.83,15.24 38.1,16.51 38.1,21.59 36.83,22.86 JP1.10 | X4.6 25.4,86.36 22.86,86.36 21.59,87.63 21.57,87.61 U1.1
  Bottom 0.305: JP1.10 36.83,85.09 34.29,87.63 X4.6
CHA_B
  Top 0.305: X13.4 97.79,15.24 99.06,16.51 99.06,21.59 97.79,22.86 JP3.10 | X10.6 86.36,86.36 83.82,86.36 82.55,87.63 82.53,87.61 U2.1
  Bottom 0.305: JP3.10 97.79,85.09 95.25,87.63 X10.6
CHA_C
  Top 0.305: X19.4 158.75,15.24 160.02,16.51 160.02,21.59 158.75,22.86 JP5.10 | X16.6 147.32,86.36 144.78,86.36 143.51,87.63 140.66,87.63 U3.1
  Bottom 0.305: JP5.10 158.75,85.09 156.21,87.63 X16.6
CHB_A
  Top 0.305: X7.2 JP1.12 | X4.8 25.4,83.82 17.14,83.82 16.83,84.14 U1.4
  Bottom 0.305: JP1.12 31.75,82.55 29.21,85.09 X4.8
CHB_B
  Top 0.305: X13.2 JP3.12 | X10.8 86.36,83.82 78.11,83.82 77.79,84.14 U2.4
  Bottom 0.305: JP3.12 92.71,82.55 90.17,85.09 X10.8
CHB_C
  Top 0.305: X19.2 JP5.12 | X16.8 147.32,83.82 139.06,83.82 138.75,84.14 U3.4
  Bottom 0.305: JP5.12 153.67,82.55 151.13,85.09 X16.8
DIN1_A
  Top 0.305: JP2.4 41.91,11.43 44.45,8.89 X5.2
DIN1_B
  Top 0.305: JP4.4 102.87,11.43 105.41,8.89 X11.2
DIN1_C
  Top 0.305: JP6.4 163.83,11.43 166.37,8.89 X17.2
DIN2_A
  Top 0.305: JP2.3 39.37,10.16 41.91,7.62 X5.1
DIN2_B
  Top 0.305: JP4.3 100.33,10.16 102.87,7.62 X11.1
DIN2_C
  Top 0.305: JP6.3 161.29,10.16 163.83,7.62 X17.1
GND
  pour Top (isolate 0.305): 0,101.6 0,0 190.5,0 190.5,101.6
  pour Bottom (isolate 0.305): 0,101.6 190.5,101.6 190.5,0 0,0
HS1_A
  Bottom 1.524: JP1.7 44.45,86.36 48.26,90.17 X3.1
HS1_B
  Bottom 1.524: JP3.7 105.41,86.36 109.22,90.17 X9.1
HS1_C
  Bottom 1.524: JP5.7 166.37,86.36 170.18,90.17 X15.1
HS2_A
  Bottom 1.524: JP1.8 41.91,87.63 45.72,91.44 X3.2
HS2_B
  Bottom 1.524: JP3.8 102.87,87.63 106.68,91.44 X9.2
HS2_C
  Bottom 1.524: JP5.8 163.83,87.63 167.64,91.44 X15.2
HS3_A
  Bottom 1.524: JP1.9 39.37,88.9 43.18,92.71 X3.3
HS3_B
  Bottom 1.524: JP3.9 100.33,88.9 104.14,92.71 X9.3
HS3_C
  Bottom 1.524: JP5.9 161.29,88.9 165.1,92.71 X15.3
MW1_A
  Top 1.524: L1.2 54.61,67.31 | 54.61,67.31 54.61,69.85 | 54.61,69.85 54.61,72.39 58.42,76.2 X2.1 | C2.1 54.61,69.85 | C5.1 54.61,67.31
MW1_B
  Top 1.524: L4.2 115.57,67.31 | 115.57,67.31 115.57,69.85 | 115.57,69.85 115.57,72.39 119.38,76.2 X8.1 | C9.1 115.57,69.85 | C12.1 115.57,67.31
MW1_C
  Top 1.524: L7.2 176.53,67.31 | 176.53,67.31 176.53,69.85 | 176.53,69.85 176.53,72.39 180.34,76.2 X14.1 | C16.1 176.53,69.85 | C19.1 176.53,67.31
MW2_A
  Top 1.524: L2.2 39.37,67.31 | 39.37,67.31 39.37,69.85 | 39.37,69.85 39.37,72.39 55.88,88.9 X2.2 | C3.1 39.37,69.85 | C6.1 39.37,67.31
MW2_B
  Top 1.524: L5.2 100.33,67.31 | 100.33,67.31 100.33,69.85 | 100.33,69.85 100.33,72.39 116.84,88.9 X8.2 | C10.1 100.33,69.85 | C13.1 100.33,67.31
MW2_C
  Top 1.524: L8.2 161.29,67.31 | 161.29,67.31 161.29,69.85 | 161.29,69.85 161.29,72.39 177.8,88.9 X14.2 | C17.1 161.29,69.85 | C20.1 161.29,67.31
MW3_A
  Top 1.524: L3.2 24.13,67.31 | 24.13,67.31 24.13,69.85 | 24.13,69.85 24.13,72.39 26.67,74.93 36.83,74.93 53.34,91.44 X2.3 | C4.1 24.13,69.85 | C7.1 24.13,67.31
MW3_B
  Top 1.524: L6.2 85.09,67.31 | 85.09,67.31 85.09,69.85 | 85.09,69.85 85.09,72.39 87.63,74.93 97.79,74.93 114.3,91.44 X8.3 | C11.1 85.09,69.85 | C14.1 85.09,67.31
MW3_C
  Top 1.524: L9.2 146.05,67.31 | 146.05,67.31 146.05,69.85 | 146.05,69.85 146.05,72.39 148.59,74.93 158.75,74.93 175.26,91.44 X14.3 | C18.1 146.05,69.85 | C21.1 146.05,67.31
N$1
  Top 0.508: R1.2 59.69,67.73 C5.2
N$2
  Top 0.508: R2.2 44.45,67.73 C6.2
N$3
  Top 0.508: R3.2 29.21,67.73 C7.2
N$4
  Top 0.508: R4.2 120.65,67.73 C12.2
N$5
  Top 0.508: R5.2 105.41,67.73 C13.2
N$6
  Top 0.508: R6.2 90.17,67.73 C14.2
N$7
  Top 0.508: R6.1 90.17,69.43 C11.2
N$8
  Top 0.508: R5.1 105.41,69.43 C10.2
N$9
  Top 0.508: R4.1 120.65,69.43 C9.2
N$10
  Top 0.508: R7.2 181.61,67.73 C19.2
N$11
  Top 0.508: R8.2 166.37,67.73 C20.2
N$12
  Top 0.508: R9.2 151.13,67.73 C21.2
N$13
  Top 0.508: R9.1 151.13,69.43 C18.2
N$14
  Top 0.508: R8.1 166.37,69.43 C17.2
N$15
  Top 0.508: R3.1 29.21,69.43 C4.2
N$16
  Top 0.508: R2.1 44.45,69.43 C3.2
N$17
  Top 0.508: R1.1 59.69,69.43 C2.2
N$18
  Top 0.508: R7.1 181.61,69.43 C16.2
VCC
  Top 1.524: X1.1 8.41,15.24 F1.1
  Bottom 1.524: F1.1 F2.1 F3.1
VDD_A
  Top 1.524: D1.C 16.51,20.32 | 16.51,20.32 C1.+ | F1.2 16.51,20.32
  Bottom 1.524: JP1.4 52.07,31.75 C1.+
VDD_B
  Top 1.524: D3.C 77.47,20.32 | 77.47,20.32 C8.+ | F2.2 77.47,20.32
  Bottom 1.524: JP3.4 113.03,31.75 C8.+
VDD_C
  Top 1.524: C15.+ D5.C 138.43,20.32 F3.2
  Bottom 1.524: JP5.4 173.99,31.75 C15.+
~MW1_A
  Top 1.524: JP1.1 59.69,45.72 54.61,50.8 L1.1
~MW1_B
  Top 1.524: JP3.1 120.65,45.72 115.57,50.8 L4.1
~MW1_C
  Top 1.524: JP5.1 181.61,45.72 176.53,50.8 L7.1
~MW2_A
  Top 1.524: JP1.2 57.15,45.09 52.7,49.53 40.64,49.53 39.37,50.8 L2.1
~MW2_B
  Top 1.524: JP3.2 118.11,45.09 113.67,49.53 101.6,49.53 100.33,50.8 L5.1
~MW2_C
  Top 1.524: JP5.2 179.07,45.09 174.62,49.53 162.56,49.53 161.29,50.8 L8.1
~MW3_A
  Top 1.524: JP1.3 54.61,44.45 52.07,46.99 26.67,46.99 24.13,49.53 L3.1
~MW3_B
  Top 1.524: JP3.3 115.57,44.45 113.03,46.99 87.63,46.99 85.09,49.53 L6.1
~MW3_C
  Top 1.524: JP5.3 176.53,44.45 173.99,46.99 148.59,46.99 146.05,49.53 L9.1

### Text on the board
tPlace: GND | +5V | HS3 | HS2 | HS1 | MW3 | MW2 | MW1 | GND | +5V | HS3 | HS2 | HS1 | MW3 | MW2 | MW1 | GND | +5V | HS3 | HS2 | HS1 | MW3 | MW2 | MW1 | Mark Aldritz Dela Virgen / University of Central Florida | R3 | CUBE Motor Driver Board | VCC | GND | !CHB | CHB | !CHA | CHA | DIN2 | DIN1 | AIN1- | GND | AIN1+ | !CHB | CHB | !CHA | CHA | DIN2 | DIN1 | AIN1- | GND | AIN1+ | !CHB | CHB | !CHA | CHA | DIN2 | DIN1 | AIN1- | GND | AIN1+